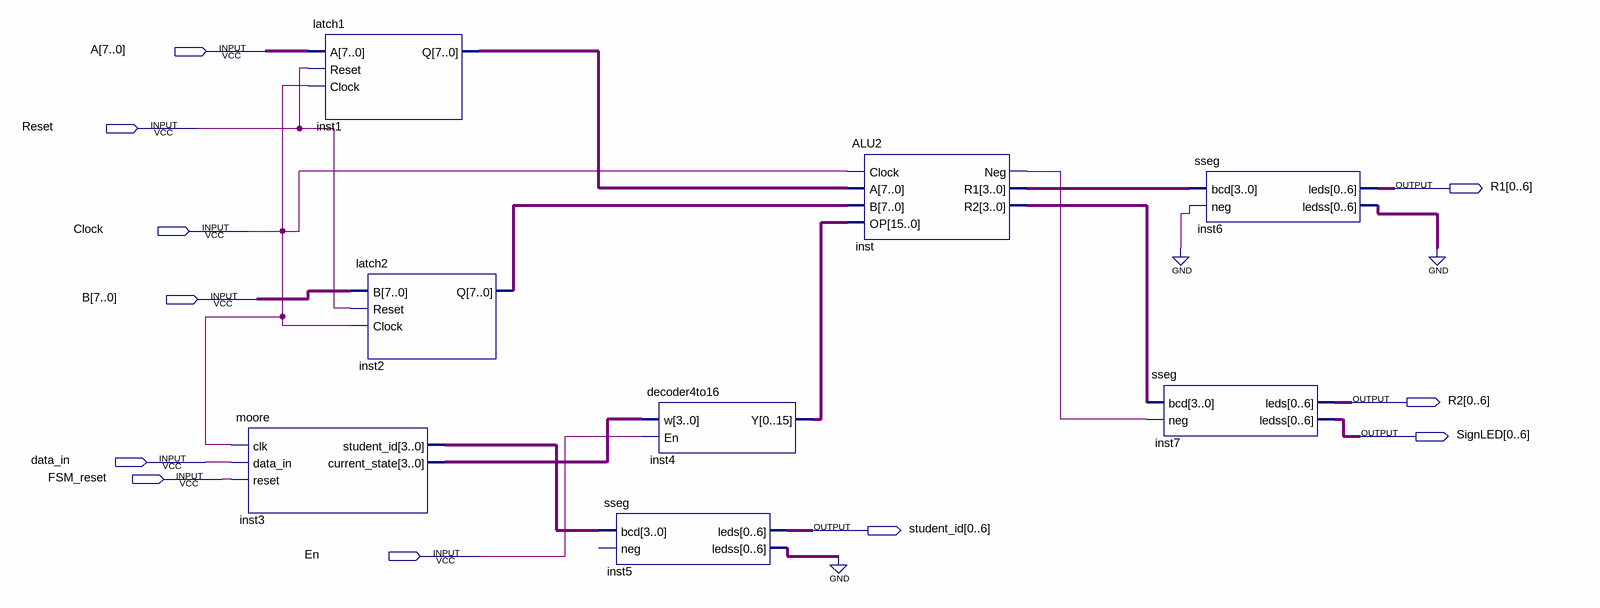
[diagram p0: schematic sheet]
// Quartus schematic ALU2Block.bdf as structural Verilog: 8 symbols, 11 pins
module ALU2Block (
  input  [7:0] A,
  input  Reset,
  input  Clock,
  input  [7:0] B,
  input  data_in,
  input  FSM_reset,
  input  En,
  output [0:6] R1,
  output [0:6] R2,
  output [0:6] SignLED,
  output [0:6] student_id
);

  wire inst_neg;
  wire [3:0] inst3_current_state, inst3_student_id, inst_r1, inst_r2;
  wire [6:0] inst5_ledss, inst6_ledss;
  wire [7:0] inst1_q, inst2_q;
  wire [15:0] inst4_y;

  moore inst3 (
    .clk(Clock), .data_in(data_in), .reset(FSM_reset), .student_id(inst3_student_id),
    .current_state(inst3_current_state));
  latch1 inst1 (.A(A), .Reset(Reset), .Clock(Clock), .Q(inst1_q));
  latch2 inst2 (.B(B), .Reset(Reset), .Clock(Clock), .Q(inst2_q));
  decoder4to16 inst4 (.w(inst3_current_state), .En(En), .Y(inst4_y));
  sseg inst5 (.bcd(inst3_student_id), .leds(student_id), .ledss(inst5_ledss));  // open: neg
  ALU2 inst (.Clock(Clock), .A(inst1_q), .B(inst2_q), .OP(inst4_y), .Neg(inst_neg), .R1(inst_r1), .R2(inst_r2));
  sseg inst6 (.bcd(inst_r1), .neg(1'b0), .leds(R1), .ledss(inst6_ledss));
  sseg inst7 (.bcd(inst_r2), .neg(inst_neg), .leds(R2), .ledss(SignLED));
  // also tied to GND on the sheet: {inst6_ledss[0], inst6_ledss[1], inst6_ledss[2], inst6_ledss[3], inst6_ledss[4], inst6_ledss[5], inst6_ledss[6], inst5_ledss[0], inst5_ledss[1], inst5_ledss[2], inst5_ledss[3], inst5_ledss[4], inst5_ledss[5], inst5_ledss[6]}
endmodule
